# Altium schematic sheet controlled rectifier2.SchDoc
size A4
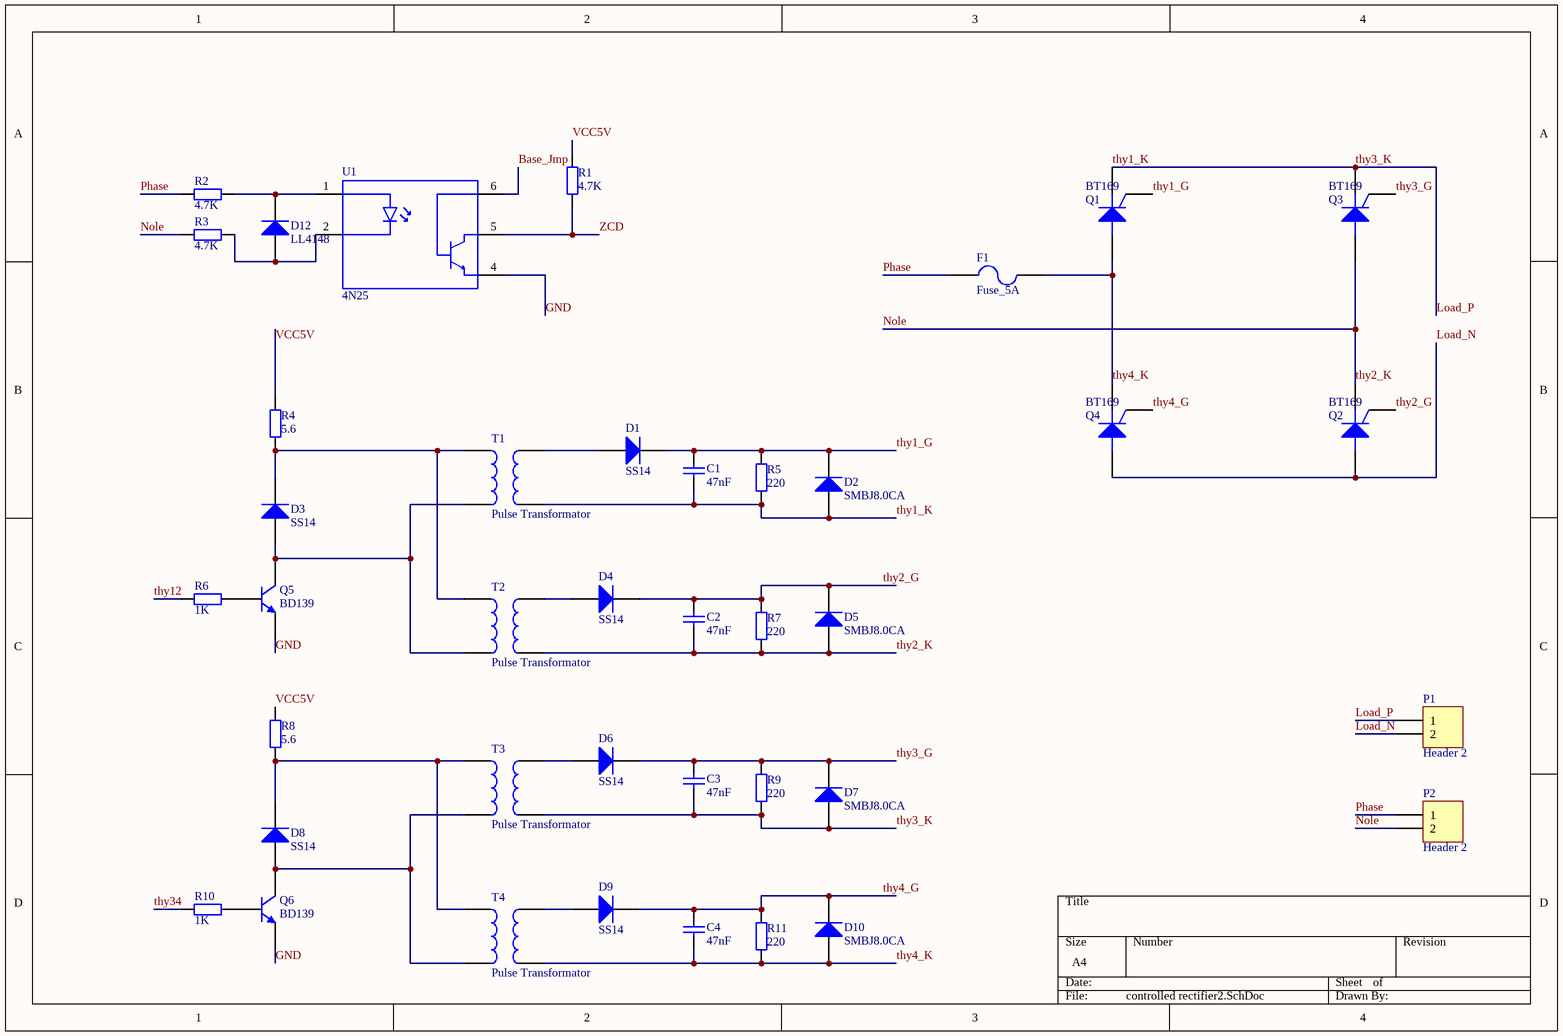
[diagram p0: controlled rectifier2.SchDoc]

## Parts
C1  47nF  [CAPS_0805]
C2  47nF  [CAPS_0805]
C3  47nF  [CAPS_0805]
C4  47nF  [CAPS_0805]
D1  SS14  [DO-214AC]
D2  SMBJ8.0CA  [SMC]
D3  SS14  [DO-214AC]
D4  SS14  [DO-214AC]
D5  SMBJ8.0CA  [SMC]
D6  SS14  [DO-214AC]
D7  SMBJ8.0CA  [SMC]
D8  SS14  [DO-214AC]
D9  SS14  [DO-214AC]
D10  SMBJ8.0CA  [SMC]
D12  LL4148  [SOD80, LL-34]
F1  Fuse_5A  [fuse-2]
P1  Header 2  [Phoenix 2 Pin -RA]
P2  Header 2  [Phoenix 2 Pin -RA]
Q1  BT169  [BT169]
Q2  BT169  [BT169]
Q3  BT169  [BT169]
Q4  BT169  [BT169]
Q5  BD139  [BD139]
Q6  BD139  [BD139]
R1  4.7K  [res_0805]
R2  4.7K  [res_0805]
R3  4.7K  [res_0805]
R4  5.6  [res_0805]
R5  220  [res_0805]
R6  1K  [res_0805]
R7  220  [res_0805]
R8  5.6  [res_0805]
R9  220  [res_0805]
R10  1K  [res_0805]
R11  220  [res_0805]
T1  Pulse Transformator  [Pulse Trans_Small]
T2  Pulse Transformator  [Pulse Trans_Small]
T3  Pulse Transformator  [Pulse Trans_Small]
T4  Pulse Transformator  [Pulse Trans_Small]
U1  4N25  [DIP762W50P254L712H400Q6N]

## Nets
Base_Jmp: U1.6(B)
GND: Q5.3(E) Q6.3(E) U1.4(E)
Load_N: P1.2 Q2.1(A) Q4.1(A)
Load_P: C1.1 C3.1 D2.1(A) D7.1(A) P1.1 Q1.3(K) Q3.3(K) R5.1 R9.1 T1.4 T3.4  [also labelled thy1_K, thy3_K]
Nole: C2.1 D5.1(A) P2.2 Q2.3(K) Q3.1(A) R3.1 R7.1 T2.4  [also labelled thy2_K]
Phase: F1.1 P2.1 R2.1
thy1_G: C1.2 D1.2(K) D2.2(K) Q1.2(G) R5.2
thy2_G: C2.2 D4.2(K) D5.2(K) Q2.2(G) R7.2
thy3_G: C3.2 D6.2(K) D7.2(K) Q3.2(G) R9.2
thy4_G: C4.2 D9.2(K) D10.2(K) Q4.2(G) R11.2
thy4_K: C4.1 D10.1(A) F1.2 Q1.1(A) Q4.3(K) R11.1 T4.4
thy12: R6.1
thy34: R10.1
VCC5V: R1.2 R4.2 R8.2
ZCD: R1.1 U1.5(C)
NetD1_1: D1.1(A) T1.3
NetD3_1: D3.1(A) Q5.1(C) T1.2 T2.2
NetD3_2: D3.2(K) R4.1 T1.1 T2.1
NetD4_1: D4.1(A) T2.3
NetD6_1: D6.1(A) T3.3
NetD8_1: D8.1(A) Q6.1(C) T3.2 T4.2
NetD8_2: D8.2(K) R8.1 T3.1 T4.1
NetD9_1: D9.1(A) T4.3
NetD12_1: D12.1(A) R3.2 U1.2(K)
NetD12_2: D12.2(K) R2.2 U1.1(A)
NetQ5_2: Q5.2(B) R6.2
NetQ6_2: Q6.2(B) R10.2

## Library data of the parts
C1-C4 = CAP SMD 0805: CAP 0805; Designer: Abbas Basereh; Desc.: CAP SMD 0805; Data: 16-12-2016
D1-D10 D12 = Diode: Default Diode; Published: 8-Jun-2000; LatestRevisionDate: 17-Jul-2002; LatestRevisionNote: Re-released for DXP Platform.; PackageVersion: Sep-1996; PackageReference: SMC; Publisher: Altium Limited; PackageDescription: DO-214-AB/SMC; 2 C-Bend Leads; Body 7.9 x 5.9 mm, inc. leads (LxW); Code_JEDEC: DO-214-AB
F1 = Fuse 2: Fuse; Published: 8-Jun-2000; LatestRevisionDate: 17-Jul-2002; LatestRevisionNote: Re-released for DXP Platform.; PackageReference: PIN-W2/E2.8; Publisher: Altium Limited; PackageDescription: Thru-Hole; 2 Leads
P1 P2 = Header 2: Header, 2-Pin; LatestRevisionDate: 17-Jul-2002; LatestRevisionNote: Re-released for DXP Platform.; Publisher: Altium Limited
Q1-Q4 = SCR: Silicon Controlled Rectifier; Published: 8-Jun-2000; LatestRevisionDate: 17-Jul-2002; LatestRevisionNote: Re-released for DXP Platform.; PackageReference: TO-220-AB; Publisher: Altium Limited; Code_JEDEC: TO-220-AB
Q5 Q6 = NPN: NPN Bipolar Transistor; Published: 8-Jun-2000; LatestRevisionDate: 17-Jul-2002; LatestRevisionNote: Re-released for DXP Platform.; PackageReference: TO-226-AA; Publisher: Altium Limited; PackageDescription: TO, Flat Index; 3 In-Line, Axial Leads; Body Dia. 4.8mm; Leads 0.55 x 0.51 mm (max); Code_JEDEC: TO-226-AA
R1-R3 = Res2: Resistor; Published: 8-Jun-2000; LatestRevisionDate: 17-Jul-2002; LatestRevisionNote: Re-released for DXP Platform.; PackageReference: AXIAL-0.4; Publisher: Altium Limited; PackageDescription: Axial Device, Thru-Hole; 2 Leads; 0.4 in Pin Spacing; Value: 4.7K
R4-R11 = Res2: Resistor; Value: 4.7K; Published: 8-Jun-2000; LatestRevisionDate: 17-Jul-2002; LatestRevisionNote: Re-released for DXP Platform.; PackageReference: AXIAL-0.4; Publisher: Altium Limited; PackageDescription: Axial Device, Thru-Hole; 2 Leads; 0.4 in Pin Spacing
T1-T4 = Trans: Transformer; Published: 24-Mar-1999; LatestRevisionDate: 08-Jul-2005; LatestRevisionNote: Mech Layer 1 removed.; PackageReference: TRANS; Publisher: Altium Limited; PackageDescription: Transformer; 4 Leads
U1 = 4N25: Optoisolator Transistor with Base Output 5000Vrms 1 Channel 6-DIP; MF: Vishay Semiconductor; Package: DIP-6 Lite-On; Value: *; Price: None; MP: 4N25; SnapEDA_Link: https://www.snapeda.com/parts/4N25/Vishay%20Semiconductor%20Opto%20Division/view-part/641454/?ref=snap; Availability: Unavailable